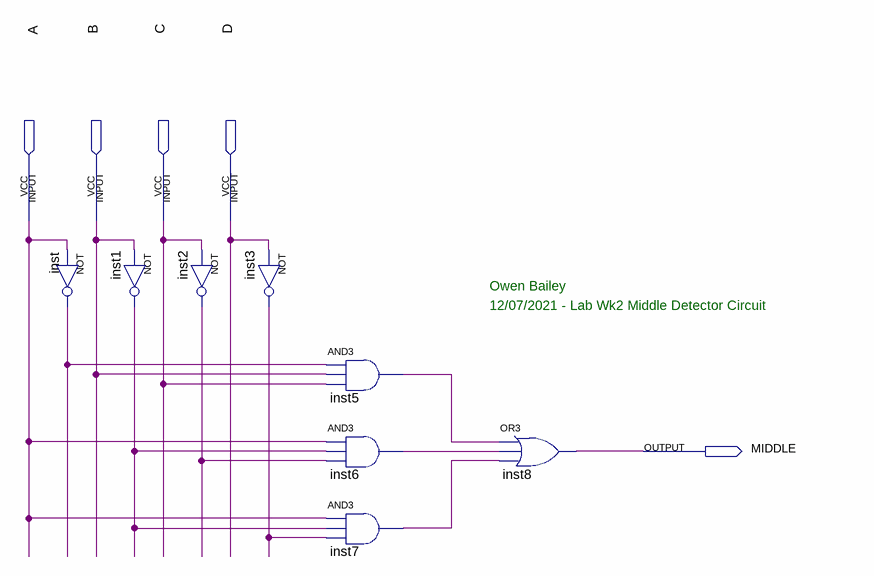
[diagram p0: schematic sheet]
// Quartus schematic middledetector.bdf as structural Verilog: 8 symbols, 5 pins
module middledetector (
  input  A,
  input  B,
  input  C,
  input  D,
  output MIDDLE
);

  wire inst1_out, inst2_out, inst3_out, inst5_out, inst6_out, inst7_out, inst_out;

  not inst (inst_out, A);
  not inst1 (inst1_out, B);
  not inst2 (inst2_out, C);
  not inst3 (inst3_out, D);
  and inst5 (inst5_out, inst_out, B, C);
  and inst6 (inst6_out, A, inst1_out, inst2_out);
  and inst7 (inst7_out, A, inst1_out, inst3_out);
  or inst8 (MIDDLE, inst5_out, inst6_out, inst7_out);

  // Notes on the sheet:
  //   Owen Bailey
  //   12/07/2021 - Lab Wk2 Middle Detector Circuit
endmodule
